# EasyEDA schematic GPS + MPU Schematic.json
TITLE: Sheet_1; REV: 1.0; Date: 2024-02-06; Sheet: 1/1; Drawn By: akshsable96; Company: Your Company
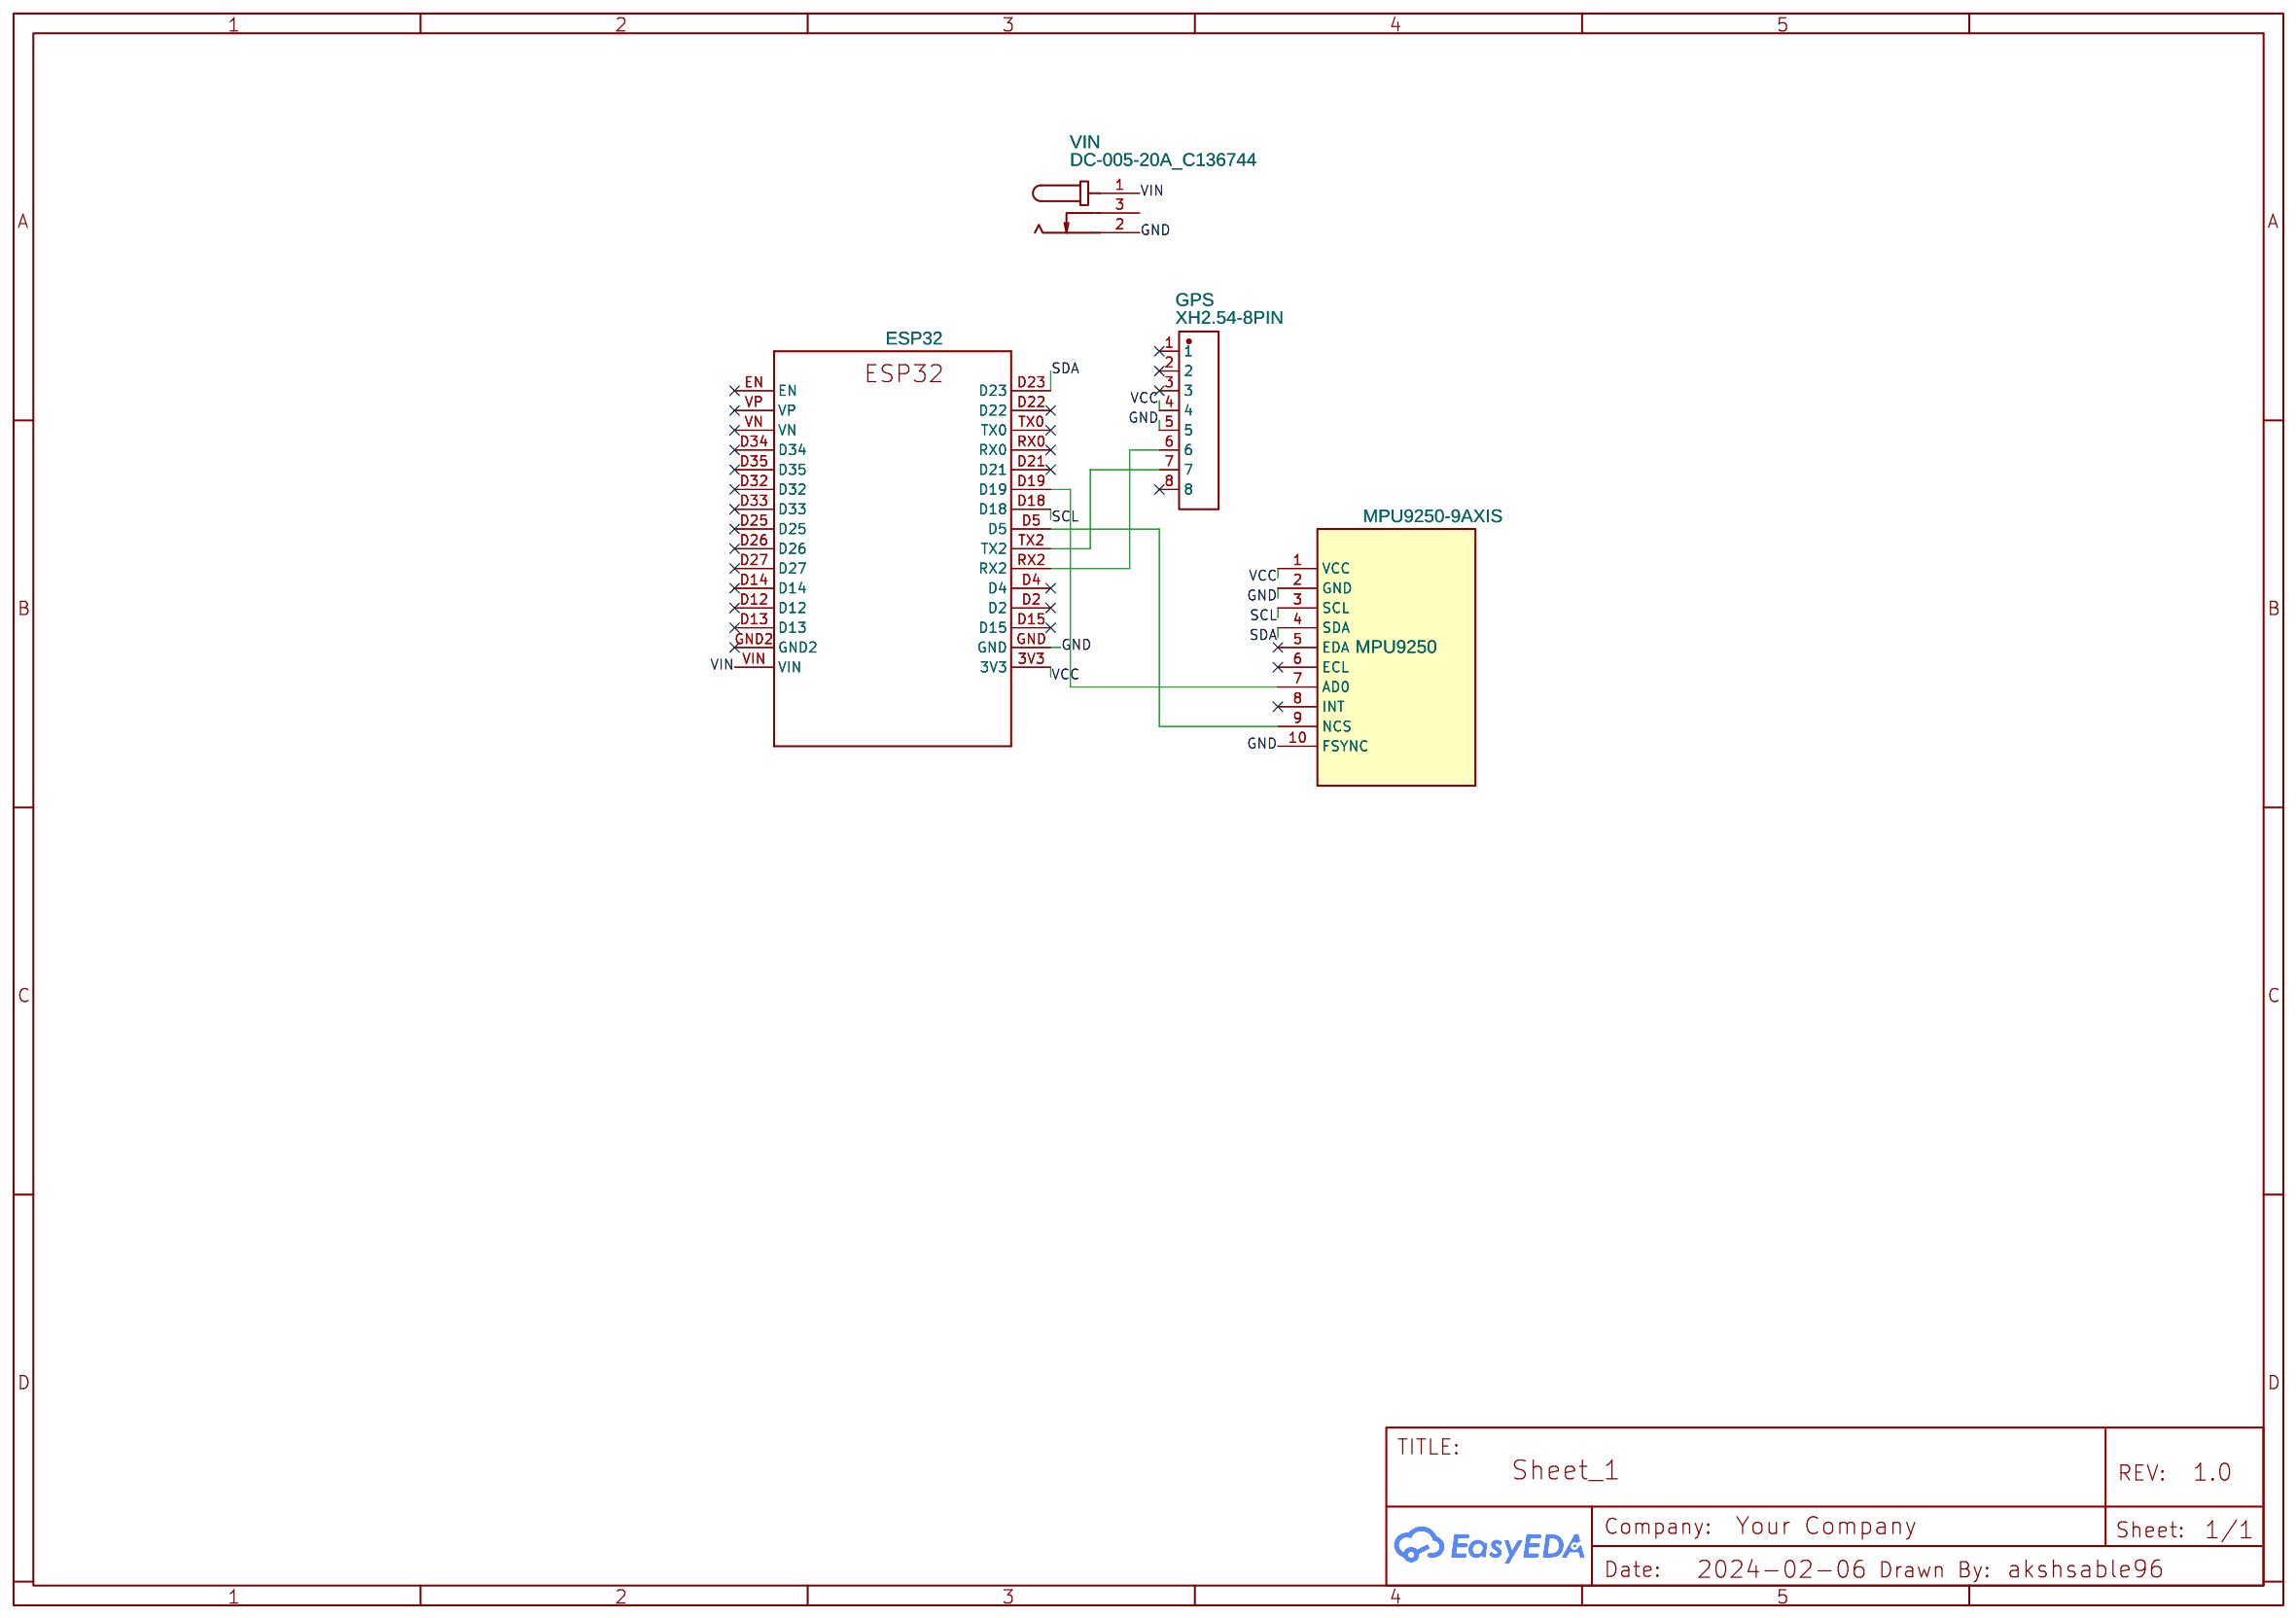
[diagram p0: schematic sheet]

## Parts
2  ESP32  [ESP32-DEVKITV1_ESP32-DEVKITV1]
GPS  XH2.54-8PIN  [CONN-TH_8P-P2.54_XH2.54_C9900012080]
MPU9250  MPU9250-9AXIS  [MPU9250-9AXIS]
VIN  DC-005-20A_C136744  [DC-IN-TH_DC-005-20A]

## Library data of the parts
2 = ESP32-DEVKIT-V1-30PIN: Contributor: KiraKira san
GPS = XH2.54-8PIN: Contributor: lcsc; Supplier: LCSC; Supplier Part: C9900014929; Manufacturer: null; JLCPCB Part Class: Extended Part
MPU9250 = MPU9250-9AXIS: Contributor: Rudiawan Edwin, M.Si, M.PKim
VIN = DC-005-20A_C136744: Supplier: LCSC; Manufacturer: 韩国韩荣; Manufacturer Part: DC-005-20A; Contributor: Hemanth Kumar; Supplier Part: C136744; JLCPCB Part Class: Extended Part

## Nets
GND: 2.GND GPS.5 MPU9250.2(GND) MPU9250.10(FSYNC) VIN.2
VCC: 2.3V3 GPS.4 MPU9250.1(VCC)
VIN: 2.VIN VIN.1
SCL: 2.D18 MPU9250.3(SCL)
SDA: 2.D23 MPU9250.4(SDA)
Net-(2-D5): 2.D5 MPU9250.9(NCS)
Net-(2-D19): 2.D19 MPU9250.7(AD0)
Net-(2-RX2): 2.RX2 GPS.6
Net-(2-TX2): 2.TX2 GPS.7

Not connected (* = marked no-connect by the designer): 2 D2* D4* D12* D13* D14* D15* D21* D22* D25* D26* D27* D32* D33* D34* D35* EN* GND2* RX0* TX0* VN* VP*; GPS 1* 2* 3* 8*; MPU9250 5(EDA)* 6(ECL)* 8(INT)*; VIN 3
